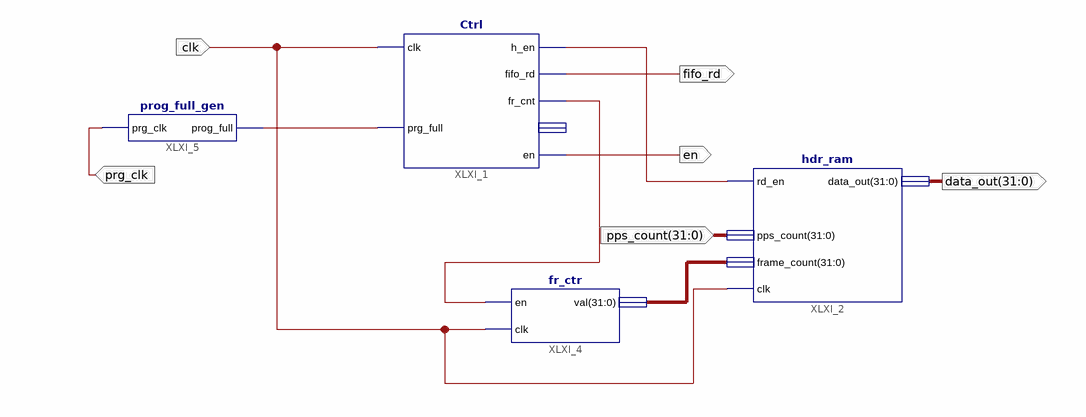
[diagram p0: schematic sheet 1]
// Xilinx ISE schematic ram_test.sch (virtex5) as structural Verilog: 4 symbols, 6 ports
module ram_test (
  input  clk,
  input  [31:0] pps_count,
  input  prg_clk,
  output [31:0] data_out,
  output fifo_rd,
  output en
);

  wire prog_full, XLXN_4, XLXN_8;
  wire [31:0] XLXN_13;

  Ctrl XLXI_1 (
    .clk(clk), .prg_full(prog_full), .h_en(XLXN_4), .fifo_rd(fifo_rd), .fr_cnt(XLXN_8), .en(en));  // open: Header_Address
  hdr_ram XLXI_2 (.rd_en(XLXN_4), .pps_count(pps_count), .frame_count(XLXN_13), .data_out(data_out), .clk(clk));
  fr_ctr XLXI_4 (.en(XLXN_8), .clk(clk), .val(XLXN_13));
  prog_full_gen XLXI_5 (.prg_clk(prg_clk), .prog_full(prog_full));
endmodule
